# Altium schematic sheet Switches.SchDoc
size A; SheetNumber: 7
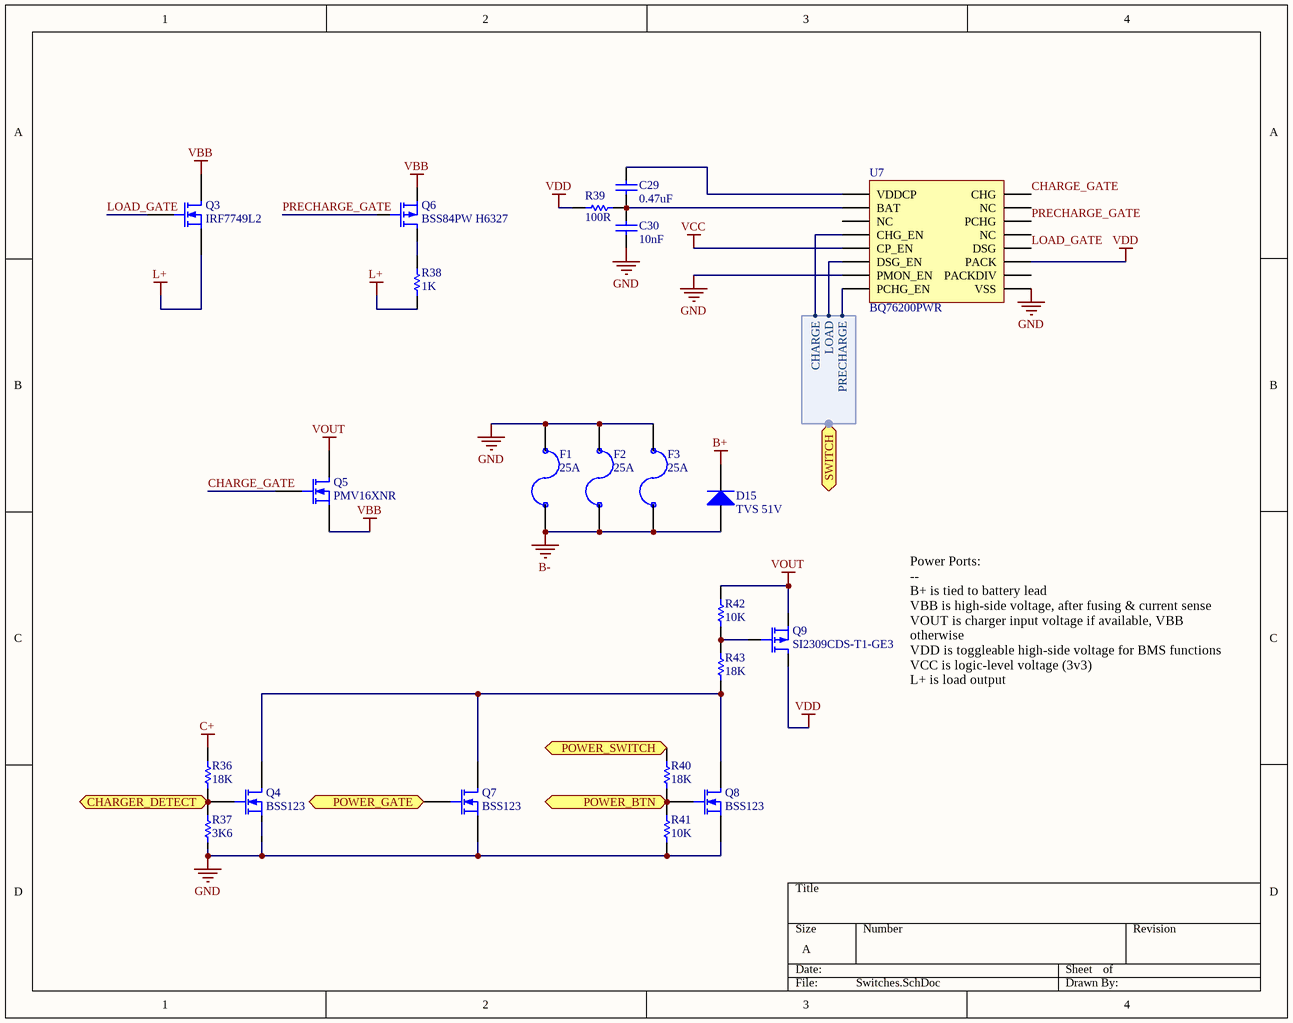
[diagram p0: Switches.SchDoc]

## Parts
C29  value 0.47uF  [C0603[1608X92]]  (hidden comment: 0.47uF 50V 0603)
C30  value 10nF  [C0402[1005X55]]  (hidden comment: 10nF 50V 0402)
D15  TVS 51V  [VISH-DO-214AC-2_N]
F1  Current: 25A  [1206_FUSE]  (hidden comment: FUSE 1206)
F2  Current: 25A  [1206_FUSE]  (hidden comment: FUSE 1206)
F3  Current: 25A  [1206_FUSE]  (hidden comment: FUSE 1206)
Q3  IRF7749L2  [DIRECTFET-9]
Q4  BSS123  [SOT323-3]
Q5  PMV16XNR  [SOT23-3]
Q6  BSS84PW H6327  [SOT323-3]
Q7  BSS123  [SOT323-3]
Q8  BSS123  [SOT323-3]
Q9  SI2309CDS-T1-GE3  [SOT23-3]
R36  value 18K  [R0402[1005]]  (hidden comment: 18K 1% 0402)
R37  value 3K6  [R0402[1005]]  (hidden comment: 3K6 1% 0402)
R38  value 1K  [R0805[2012]]  (hidden comment: 1K 1% 0805)
R39  value 100R  [R0402[1005]]  (hidden comment: 100R 1% 0402)
R40  value 18K  [R0402[1005]]  (hidden comment: 18K 1% 0402)
R41  value 10K  [R0402[1005]]  (hidden comment: 10K 1% 0402)
R42  value 10K  [R0402[1005]]  (hidden comment: 10K 1% 0402)
R43  value 18K  [R0402[1005]]  (hidden comment: 18K 1% 0402)
U7  BQ76200PWR  [TSSOP-16]

## Ports
CHARGER_DETECT (out), POWER_BTN (out), POWER_GATE (in), POWER_SWITCH (in), SWITCH (harness Switches)

## Harnesses
Switches: CHARGE, LOAD, PRECHARGE

## Nets
B+: D15.1(K)
B-: D15.2(A) F1.2 F2.2 F3.2
C+: R36.2
GND: C30.1 F1.1 F2.1 F3.1 Q4.2(S) Q7.2(S) Q8.2(S) R37.1 R41.1 U7.7(PMON_EN) U7.9(VSS)
L+: Q3.2(S) R38.1
VBB: Q3.3(D) Q5.2(S) Q6.2(S)
VCC: U7.5(CP_EN)
VDD: Q9.2(D) R39.1 U7.11(PACK)
VOUT: Q5.3(D) Q9.3(S) R42.2
CHARGE_GATE: Q5.1(G) U7.16(CHG)
CHARGER_DETECT: Q4.1(G) R36.1 R37.2 ; port CHARGER_DETECT
LOAD_GATE: Q3.1(G) U7.12(DSG)
POWER_BTN: Q8.1(G) R40.1 R41.2 ; port POWER_BTN
POWER_GATE: Q7.1(G) ; port POWER_GATE
POWER_SWITCH: R40.2 ; port POWER_SWITCH
PRECHARGE_GATE: Q6.1(G) U7.14(PCHG)
NetC29_1: C29.1 C30.2 R39.2 U7.2(BAT)
NetC29_2: C29.2 U7.1(VDDCP)
NetQ4_3: Q4.3(D) Q7.3(D) Q8.3(D) R43.1
NetQ6_3: Q6.3(D) R38.2
NetQ9_1: Q9.1(G) R42.1 R43.2
NetU7_4: U7.4(CHG_EN) ; port SWITCH.CHARGE
NetU7_6: U7.6(DSG_EN) ; port SWITCH.LOAD
NetU7_8: U7.8(PCHG_EN) ; port SWITCH.PRECHARGE

Not connected (* = marked no-connect by the designer): U7 3(NC) 10(PACKDIV) 13(NC) 15(NC)

## Notes on the sheet
- Power Ports:
  --
  B+ is tied to battery lead
  VBB is high-side voltage, after fusing & current sense
  VOUT is charger input voltage if available, VBB otherwise
  VDD is toggleable high-side voltage for BMS functions
  VCC is logic-level voltage (3v3)
  L+ is load output

## Library data of the parts
C29 = CAP_0.47uF_50V_0603_10%: 0.47uF 50V 10% 0603 (1608 Metric); PartNumber: GRM188R61H474KA12D; Manufacturer: Murata; Tolerance: 10%; Mounting Technology: Surface Mount; PackageReference: 0603; PackageDescription: 0603 (1608 Metric); Voltage: 50V
C30 = CAP_10nF_50V_0402_10%: 10nF 50V 10% 0402 (1005 Metric); PartNumber: GCM155R71H103KA55D; Manufacturer: Murata; Tolerance: 10%; Mounting Technology: Surface Mount; PackageReference: 0402; PackageDescription: 0402 (1005 Metric); Voltage: 50V
D15 = CMP-0548-00253-1: Transient Voltage Suppressor, 6.40 to 231 V, 45 V Stand-off Voltage, Uni-Directional, -55 to 155 degC, 2-pin DO-214AC, Pb-Free, Tape and Reel; PartNumber: SMAJ51A-E3/61; Manufacturer: Vishay Semiconductor; IFSM: 40 A; VWM (V): 51; VBR Uni-Directional (V): 6.4 to 231; ID (uA): 1; PPPM (W): 400, 300; ComponentLink2Description: Datasheet; PackageReference: DO-214AC-2; ComponentLink3URL: http://www.vishay.com/docs/88390/smaj50a.pdf; DatasheetVersion: 12/8/2013; RoHS: TRUE; ComponentLink2URL: http://www.vishay.com/docs/88390/smaj50a.pdf; ComponentLink1Description: Manufacturer URL; PackageDescription: 2-Pin DO-214AC (SMA), Body 4.245 x 2.665 mm; Mounting Technology: Surface Mount; Packing: Tape and Reel; ComponentLink3Description: Package Specification; ComponentLink1URL: http://www.vishay.com/; Operating Junction and Storage Temperature Range: -55 to 150 degC
F1-F3 = FUSE 1206: Surface Mount Fuses UST 1206 FUSE 25A F; PartNumber: 3413.0332.22; Manufacturer: Schurter; Mounting Technology: Surface Mount; PackageReference: 1206; PackageDescription: 1206 (3216 Metric)
Q3 = IRF7749L2: N-Channel MOSFET; PartNumber: IRF7749L2TRPBF; Manufacturer: Infineon Technologies; PackageReference: DIRECTFET L8; PackageDescription: DirectFET™ Isometric L8; Mounting Technology: Surface Mount
Q4 Q7 Q8 = BSS123WQ-7-F: N-Channel MOSFET; Manufacturer: Diodes Incorporated; PackageReference: SOT-323-3; PartNumber: BSS123WQ-7-F; Mounting Technology: Surface Mount
Q5 = PMV16XNR: N-Channel MOSFET; pin to pad: 2>3 3>2; Manufacturer: NXP; PackageReference: SOT-23-3; PartNumber: PMV16XNR; Mounting Technology: Surface Mount
Q6 = BSS84PW H6327: P-Channel MOSFET; Manufacturer: Infineon; PackageReference: SOT323-3; Mounting Technology: Surface Mount; PartNumber: BSS84PW H6327
Q9 = SI2309CDS-T1-GE3: P-Channel MOSFET; Manufacturer: Vishay; PackageReference: SOT23-3; Mounting Technology: Surface Mount; PartNumber: SI2309CDS-T1-GE3
R36 R40 R43 = RES_18K_0402_1%: 18K 0.063W 1% 0402 (1005 Metric); Manufacturer: KOA Speer; PartNumber: RK73H1ETTP1802F; Power: 0.063W; Tolerance: 1%; Mounting Technology: Surface Mount; PackageReference: 0402; PackageDescription: 0402 (1005 Metric); ComponentLink1Description: Datasheet; ComponentLink1URL: http://www.koaspeer.com/catimages/Products/RK73H/RK73H.pdf
R37 = RES_3K6_0402_1%: 3K6 0.063W 1% 0402 (1005 Metric); Manufacturer: KOA Speer; PartNumber: RK73H1ETTP3601F; Tolerance: 1%; Power: 0.063W; Mounting Technology: Surface Mount; PackageReference: 0402; PackageDescription: 0402 (1005 Metric); ComponentLink1Description: Datasheet; ComponentLink1URL: http://www.koaspeer.com/catimages/Products/RK73H/RK73H.pdf
R38 = RES_1K_0805_1%: 1K 0.5W 1% 0805 (2012 Metric); Manufacturer: Panasonic; PartNumber: ERJ-P06F1001V; Tolerance: 1%; Power: 0.5W; Mounting Technology: Surface Mount; PackageReference: 0805; PackageDescription: 0805 (2012 Metric); ComponentLink1Description: Datasheet; ComponentLink1URL: https://industrial.panasonic.com/cdbs/www-data/pdf/RDA0000/AOA0000C243.pdf
R39 = RES_100R_0402_1%: 100R 0.063W 1% 0402 (1005 Metric); Manufacturer: KOA Speer; PartNumber: RK73H1ETTP1000F; Power: 0.063W; Tolerance: 1%; Mounting Technology: Surface Mount; PackageReference: 0402; PackageDescription: 0402 (1005 Metric); ComponentLink1Description: Datasheet; ComponentLink1URL: http://www.koaspeer.com/catimages/Products/RK73H/RK73H.pdf
R41 R42 = RES_10K_0402_1%: 10K 0.063W 1% 0402 (1005 Metric); Manufacturer: KOA Speer; PartNumber: RK73H1ETTP1002F; Power: 0.063W; Tolerance: 1%; Mounting Technology: Surface Mount; PackageReference: 0402; PackageDescription: 0402 (1005 Metric); ComponentLink1Description: Datasheet; ComponentLink1URL: http://www.koaspeer.com/catimages/Products/RK73H/RK73H.pdf
U7 = BQ76200PWR: Battery Management Fast high side NCH drive; Manufacturer: Texas Instruments; PartNumber: BQ76200PWR; PackageReference: TSSOP-16; Mounting Technology: Surface Mount